# EAGLE schematic ME433_sunyue (EAGLE 7.2.0)
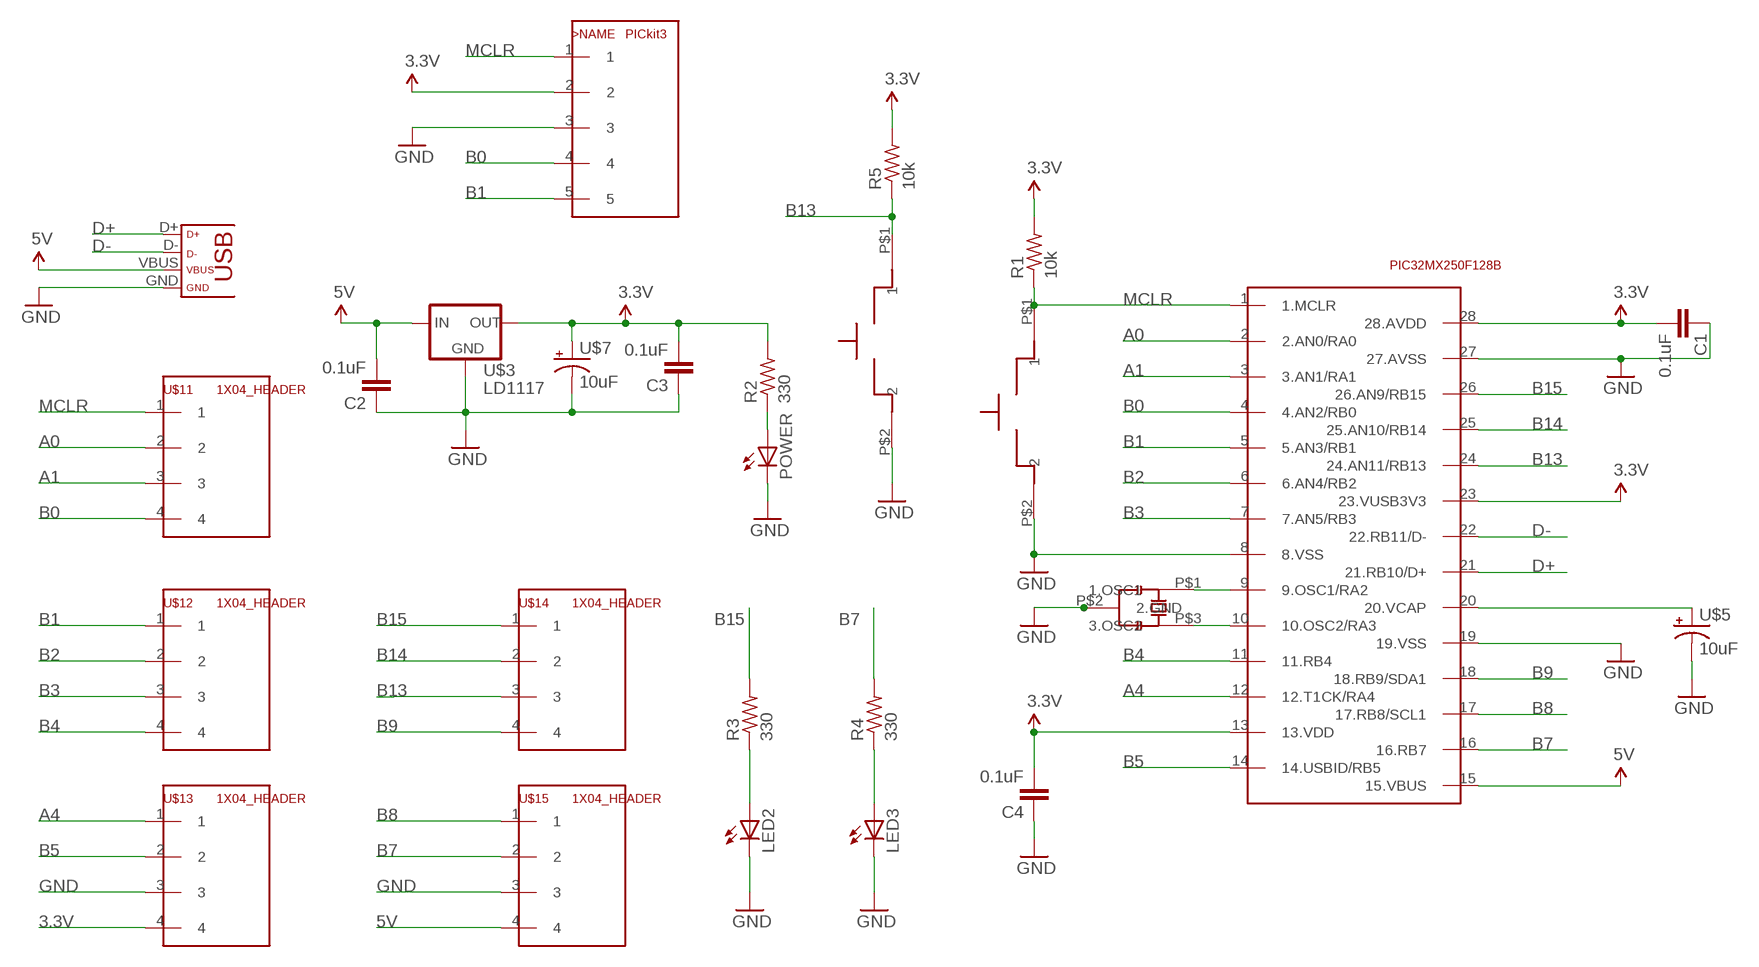
[diagram p0: schematic, sheet 1]

## Parts
>NAME  PICkit3  1X05_HEADER  [1X05]
C1  0.1uF  C-EU025-025X050  [C025-025X050]
C2  0.1uF  C-EU025-025X050  [C025-025X050]
C3  0.1uF  C-EU025-025X050  [C025-025X050]
C4  0.1uF  C-EU025-025X050  [C025-025X050]
LED2  LED3MM  [LED3MM]
LED3  LED3MM  [LED3MM]
POWER  LED3MM  [LED3MM]
R1  10k  R-US_0207/10  [0207/10]
R2  330  R-US_0207/10  [0207/10]
R3  330  R-US_0207/10  [0207/10]
R4  330  R-US_0207/10  [0207/10]
R5  10k  R-US_0207/10  [0207/10]
RESET  RESET  BUTTON  [BUTTON]
U$1  PIC32MX250F128B  [DIL28-3]
U$2  CRYSTAL  [CRYSTAL]
U$3  LD1117  [TO220]
U$5  10uF  CAP_POL  [CAP_POL_D]
U$7  10uF  CAP_POL  [CAP_POL_D]
U$9  USB  [USB-MINIB]
U$11  1X04_HEADER  [1X04]
U$12  1X04_HEADER  [1X04]
U$13  1X04_HEADER  [1X04]
U$14  1X04_HEADER  [1X04]
U$15  1X04_HEADER  [1X04]
USER  BUTTON  [BUTTON]

## Nets
3.3V: >NAME.2 C1.2 C3.2 C4.2 R1.2 R2.2 R5.2 U$1.13(13.VDD) U$1.23(23.VUSB3V3) U$1.28(28.AVDD) U$3.2(OUT) U$7.1(+) U$13.4
5V: C2.2 U$1.15(15.VBUS) U$3.3(IN) U$9.VBUS U$15.4
A0: U$1.2(2.AN0/RA0) U$11.2
A1: U$1.3(3.AN1/RA1) U$11.3
A4: U$1.12(12.T1CK/RA4) U$13.1
B0: >NAME.4 U$1.4(4.AN2/RB0) U$11.4
B1: >NAME.5 U$1.5(5.AN3/RB1) U$12.1
B2: U$1.6(6.AN4/RB2) U$12.2
B3: U$1.7(7.AN5/RB3) U$12.3
B4: U$1.11(11.RB4) U$12.4
B5: U$1.14(14.USBID/RB5) U$13.2
B7: R4.2 U$1.16(16.RB7) U$15.2
B8: U$1.17(17.RB8/SCL1) U$15.1
B9: U$1.18(18.RB9/SDA1) U$14.4
B13: R5.1 U$1.24(24.AN11/RB13) U$14.3 USER.P$1
B14: U$1.25(25.AN10/RB14) U$14.2
B15: R3.2 U$1.26(26.AN9/RB15) U$14.1
D+: U$1.21(21.RB10/D+) U$9.D+
D-: U$1.22(22.RB11/D-) U$9.D-
GND: >NAME.3 C1.1 C2.1 C3.1 C4.1 LED2.K(C) LED3.K(C) POWER.K(C) RESET.P$2 U$1.8(8.VSS) U$1.19(19.VSS) U$1.27(27.AVSS) U$2.P$2(2.GND) U$3.1(GND) U$5.2(-) U$7.2(-) U$9.GND U$13.3 U$15.3 USER.P$2
MCLR: >NAME.1 R1.1 RESET.P$1 U$1.1(1.MCLR) U$11.1
N$1: U$1.9(9.OSC1/RA2) U$2.P$1(1.OSC1)
N$2: U$1.10(10.OSC2/RA3) U$2.P$3(3.OSC2)
N$3: U$1.20(20.VCAP) U$5.1(+)
N$4: POWER.A R2.1
N$5: LED2.A R3.1
N$6: LED3.A R4.1

## Library data of the parts
>NAME = ME433:1X05_HEADER
C1-C4 = ME433:C-EU: CAPACITOR, European symbol
LED2 LED3 POWER = ME433:LED: LED OSRAM: - CHIPLED LG R971, LG N971, LY N971, LG Q971, LY Q971, LO R971, LY R971 LH N974, LH R974 LS Q976, LO Q976, LY Q976 LO Q996 - Hyper CHIPLED LW Q18S LB Q993, LB Q99A, LB R99A - SideLED LS A670, LO A670, LY A670, LG A670, LP A670 LB A673, LV A673, LT A673, LW A673 LH A674 LY A675 LS A676, LA A676, LO A676, LY A676, LW A676 LS A679, LY A679, LG A679 - Hyper Micro SIDELED® LS Y876, LA Y876, LO Y876, LY Y876 LT Y87S - SmartLED LW L88C, LW L88S LB L89C, LB L89S, LG L890 LS L89K, LO L89K, LY L89K LS L896, LA L896, LO L896, LY L896 - TOPLED LS T670, LO T670, LY T670, LG T670, LP T670 LSG T670, LSP T670, LSY T670, LOP T670, LYG T670 LG T671, LOG T671, LSG T671 LB T673, LV T673, LT T673, LW T673 LH T674 LS T676, LA T676, LO T676, LY T676, LB T676, LH T676, LSB T676, LW T676 LB T67C, LV T67C, LT T67C, LS T67K, LO T67K, LY T67K, LW E67C LS E67B, LA E67B, LO E67B, LY E67B, LB E67C, LV E67C, LT E67C LW T67C LS T679, LY T679, LG T679 LS T770, LO T770, LY T770, LG T770, LP T770 LB T773, LV T773, LT T773, LW T773 LH T774 LS E675, LA E675, LY E675, LS T675 LS T776, LA T776, LO T776, LY T776, LB T776 LHGB T686 LT T68C, LB T68C - Hyper Mini TOPLED® LB M676 - Mini TOPLED Santana® LG M470 LS M47K, LO M47K, LY M47K Source: http://www.osram.convergy.de LUXEON: - LUMILED® LXK2-PW12-R00, LXK2-PW12-S00, LXK2-PW14-U00, LXK2-PW14-V00 LXK2-PM12-R00, LXK2-PM12-S00, LXK2-PM14-U00 LXK2-PE12-Q00, LXK2-PE12-R00, LXK2-PE12-S00, LXK2-PE14-T00, LXK2-PE14-U00 LXK2-PB12-K00, LXK2-PB12-L00, LXK2-PB12-M00, LXK2-PB14-N00, LXK2-PB14-P00, LXK2-PB14-Q00 LXK2-PR12-L00, LXK2-PR12-M00, LXK2-PR14-Q00, LXK2-PR14-R00 LXK2-PD12-Q00, LXK2-PD12-R00, LXK2-PD12-S00 LXK2-PH12-R00, LXK2-PH12-S00 LXK2-PL12-P00, LXK2-PL12-Q00, LXK2-PL12-R00 Source: www.luxeon.com KINGBRIGHT: KA-3528ASYC Source: www.kingbright.com
R1-R5 = ME433:R-US_: RESISTOR, American symbol
RESET USER = ME433:BUTTON
U$1 = ME433:PIC32MX250F128B
U$2 = ME433:CRYSTAL
U$3 = ME433:LD1117
U$5 U$7 = ME433:CAP_POL
U$9 = ME433:USB
U$11-U$15 = ME433:1X04_HEADER